# EAGLE design M239A (EAGLE 6.6.0)
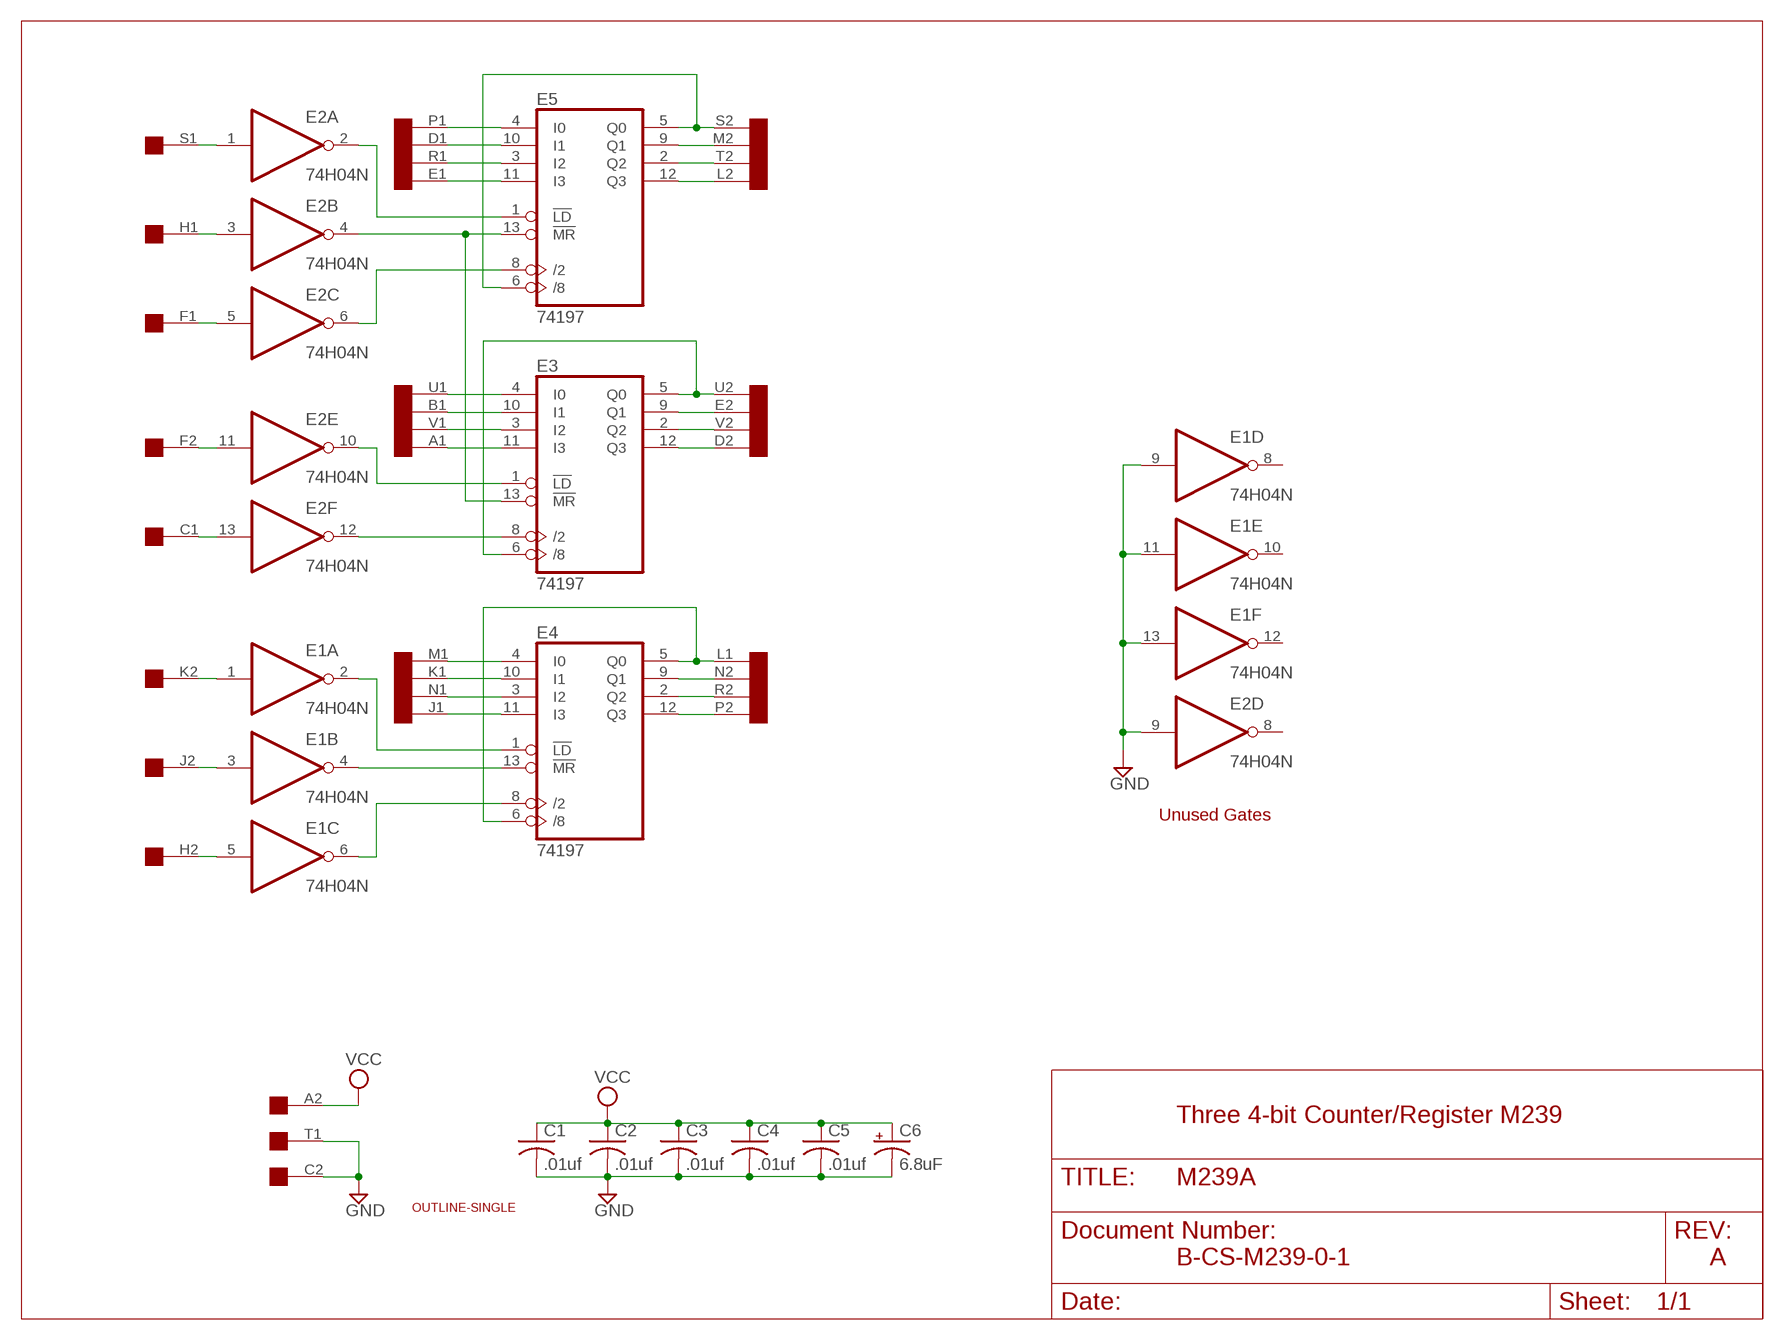
[diagram p0: schematic, sheet 1]

## Parts
C1  .01uf  C-US050-025X075  [C050-025X075]
C2  .01uf  C-US050-025X075  [C050-025X075]
C3  .01uf  C-US050-025X075  [C050-025X075]
C4  .01uf  C-US050-025X075  [C050-025X075]
C5  .01uf  C-US050-025X075  [C050-025X075]
C6  6.8uF  CPOL-USE22-6AXIAL  [E22-6]
E1  74H04N  7404N  [DIL14]
E2  74H04N  7404N  [DIL14]
E3  74197  74LS197  [DIL14]
E4  74197  74LS197  [DIL14]
E5  74197  74LS197  [DIL14]
U$1  OUTLINE-SINGLE  [SINGLE]
U$4  SINGLE  [EDGE-CON2]

## Nets
GND [Supply]: C1.2 C2.2 C3.2 C4.2 C5.2 C6.- E1.9(D:I) E1.11(E:I) E1.13(F:I) E2.9(D:I) U$4.C2 U$4.T1
N$1: E5.4(I0) U$4.P1
N$2: E5.10(I1) U$4.D1
N$3: E5.3(I2) U$4.R1
N$4: E5.11(I3) U$4.E1
N$5: E5.5(Q0) E5.6(/8) U$4.S2
N$6: E2.2(A:O) E5.1(!LD)
N$7: E2.4(B:O) E3.13(!MR) E5.13(!MR)
N$8: E2.6(C:O) E5.8(/2)
N$9: E2.1(A:I) U$4.S1
N$10: E2.3(B:I) U$4.H1
N$11: E2.5(C:I) U$4.F1
N$12: E2.10(E:O) E3.1(!LD)
N$13: E2.12(F:O) E3.8(/2)
N$14: E3.5(Q0) E3.6(/8) U$4.U2
N$15: E2.11(E:I) U$4.F2
N$16: E2.13(F:I) U$4.C1
N$17: E3.11(I3) U$4.A1
N$18: E3.3(I2) U$4.V1
N$19: E3.10(I1) U$4.B1
N$20: E3.4(I0) U$4.U1
N$21: E5.9(Q1) U$4.M2
N$22: E5.2(Q2) U$4.T2
N$23: E5.12(Q3) U$4.L2
N$24: E3.9(Q1) U$4.E2
N$25: E3.2(Q2) U$4.V2
N$26: E3.12(Q3) U$4.D2
N$27: E4.5(Q0) E4.6(/8) U$4.L1
N$28: E1.4(B:O) E4.13(!MR)
N$29: E1.6(C:O) E4.8(/2)
N$30: E1.2(A:O) E4.1(!LD)
N$31: E1.1(A:I) U$4.K2
N$32: E1.3(B:I) U$4.J2
N$33: E1.5(C:I) U$4.H2
N$34: E4.4(I0) U$4.M1
N$35: E4.10(I1) U$4.K1
N$36: E4.3(I2) U$4.N1
N$37: E4.11(I3) U$4.J1
N$38: E4.9(Q1) U$4.N2
N$39: E4.2(Q2) U$4.R2
N$40: E4.12(Q3) U$4.P2
VCC [Supply]: C1.1 C2.1 C3.1 C4.1 C5.1 C6.+ U$4.A2
Unconnected: E1.8(D:O) E1.10(E:O) E1.12(F:O) E2.8(D:O) U$4.B2

## Notes on the sheet
- Unused Gates
- Three 4-bit Counter/Register M239
- B-CS-M239-0-1 | A

## Power pins joined to a net without a drawn wire
GND: E1.7(P:GND) E2.7(P:GND) E3.7(GND) E4.7(GND) E5.7(GND)
VCC: E1.14(P:VCC) E2.14(P:VCC) E3.14(VCC) E4.14(VCC) E5.14(VCC)

## Library data of the parts
C1-C5 = rcl:C-US: CAPACITOR, American symbol
C6 = rcl:CPOL-US: POLARIZED CAPACITOR, American symbol
E1 E2 = 74xx-us:74*04: Hex INVERTER
E3-E5 = dec-con:74LS197: Loadable decade counter
U$1 = dec-con:OUTLINE-*: Board outlines for DEC boards.
U$4 = dec-con:SINGLE: Single-Height DEC board

## Net classes
1 Supply: width 0.813 mm

## Board
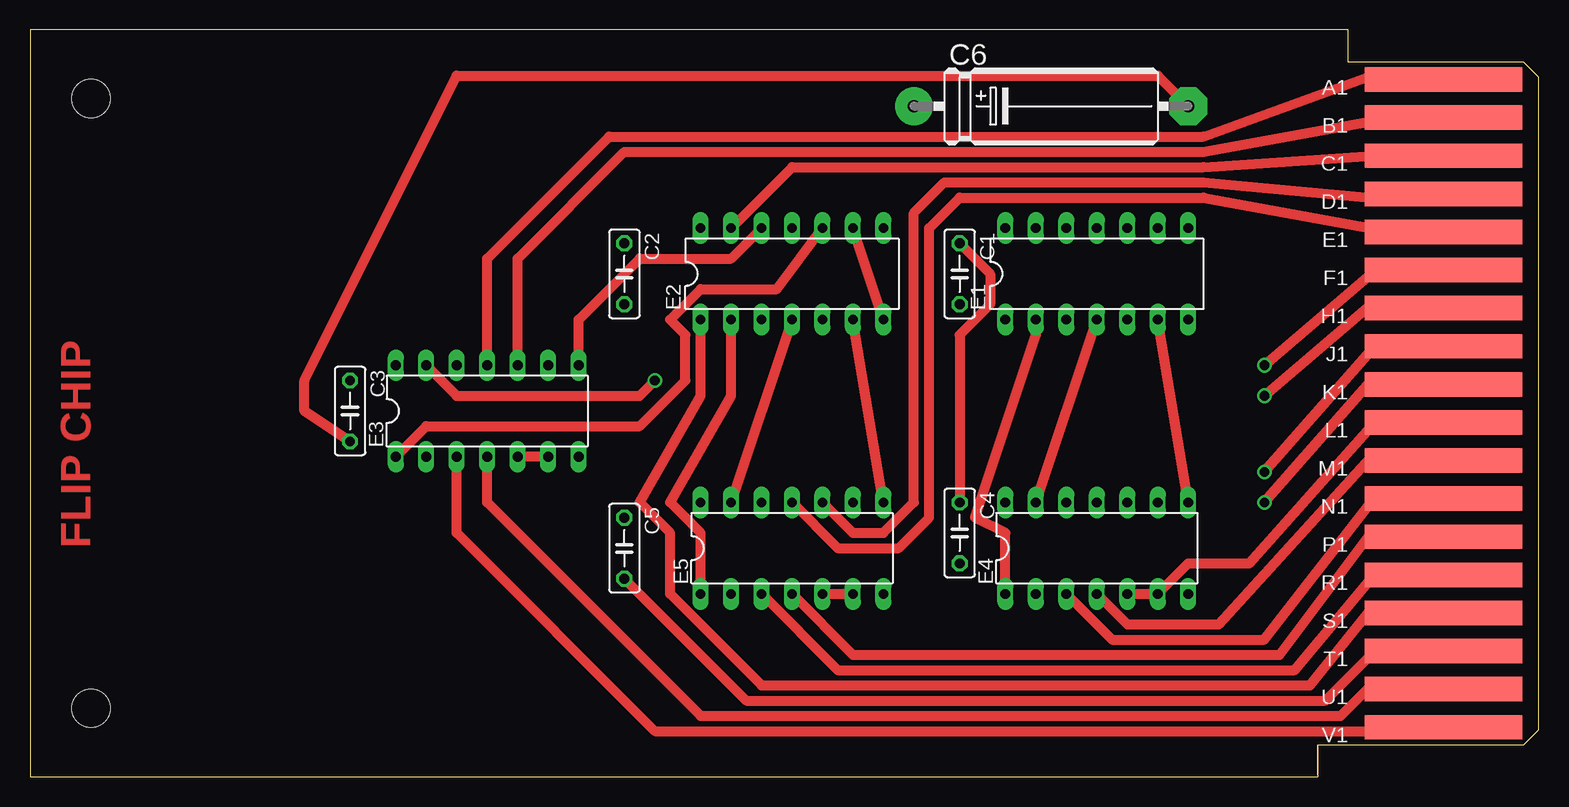
[diagram p1: board, top side]
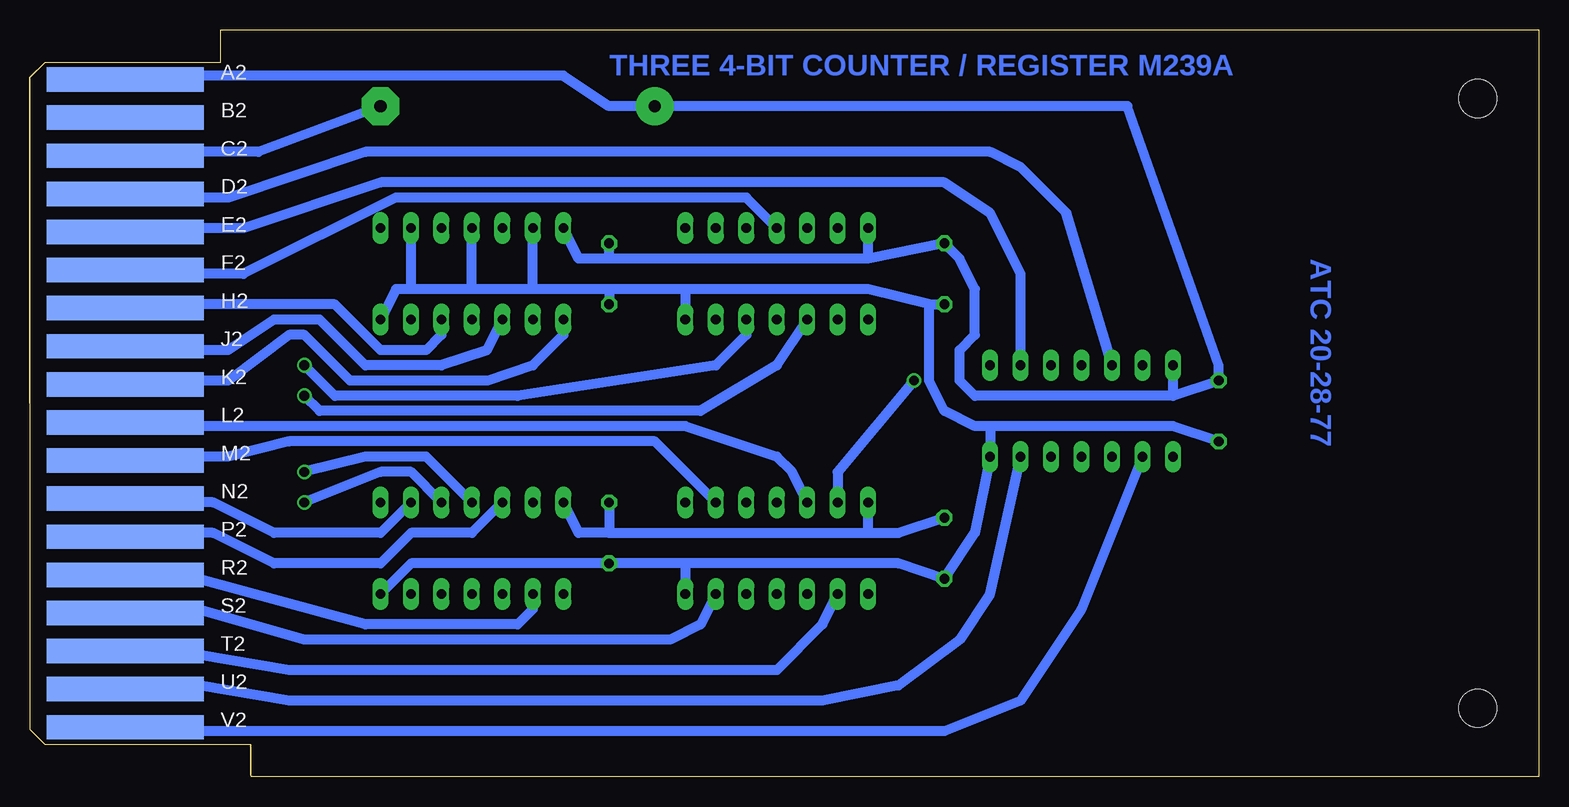
[diagram p2: board, bottom side, seen from below]

Size 125.73 x 62.23 mm. Coordinates in mm from the lower left corner, seen from the top.
Copper layers (1+16): Top 0.035mm / dielectric 1.5mm / Bottom 0.035mm
Design rules "16mils": minimum track width 16mil, minimum drill 32mil, track to track 15mil, track to pad 10mil, pad to pad 10mil, via to via 10mil, smd to smd 10mil, copper to edge 25mil, drill to drill 10mil, minimum pad ring 10mil, minimum via ring 8mil, stop-mask expansion 0mil, vias tented up to drill 0mil, thermal gap 10mil

### Footprints (pad centres in the part's own frame; a part is rotated, then mirrored left to right if it is on the bottom)
C050-025X075 = drill 0.813 octagon: 1 -2.54,0; 2 2.54,0
E22-6 = drill 1.016 pad 3.15: + -11.43,0 | drill 1.016 pad 3.15 octagon: - 11.43,0
DIL14 = drill 0.813 long: 1 -7.62,-3.81; 2 -5.08,-3.81; 3 -2.54,-3.81; 4 0,-3.81; 5 2.54,-3.81; 6 5.08,-3.81; 7 7.62,-3.81; 8 7.62,3.81; 9 5.08,3.81; 10 2.54,3.81; 11 0,3.81; 12 -2.54,3.81; 13 -5.08,3.81; 14 -7.62,3.81
SINGLE = hole 3.175: 120.65,56.515; 120.65,5.715
EDGE-CON2 = smd 13.106 x 2.032: A1 7.938,4.128; B1 7.938,7.303; C1 7.938,10.477; D1 7.938,13.652; E1 7.938,16.828; F1 7.938,20.003; H1 7.938,23.177; J1 7.938,26.352; K1 7.938,29.527; L1 7.938,32.703; M1 7.938,35.877; N1 7.938,39.053; P1 7.938,42.227; R1 7.938,45.403; S1 7.938,48.578; T1 7.938,51.752; U1 7.938,54.928; V1 7.938,58.102 | smd 13.106 x 2.032 bottom: A2 7.938,4.128; B2 7.938,7.303; C2 7.938,10.477; D2 7.938,13.652; E2 7.938,16.828; F2 7.938,20.003; H2 7.938,23.177; J2 7.938,26.352; K2 7.938,29.527; L2 7.938,32.703; M2 7.938,35.877; N2 7.938,39.053; P2 7.938,42.227; R2 7.938,45.403; S2 7.938,48.578; T2 7.938,51.752; U2 7.938,54.928; V2 7.938,58.102

### Placement (x,y rotation side)
C1  77.47,41.91 270 top
C2  49.53,41.91 270 top
C3  26.67,30.48 270 top
C4  77.47,20.32 270 top
C5  49.53,19.05 270 top
C6  85.09,55.88 0 top
E1  88.9,41.91 0 top
E2  63.5,41.91 0 top
E3  38.1,30.48 0 top
E4  88.9,19.05 0 top
E5  63.5,19.05 0 top
U$1  125.73,62.23 180 top
U$4  125.73,62.23 180 top
U$5  [FLIPCHIP]  0,0 0 top

### Tracks (layer width: path | path; a pad name or v marks a point on that pad's centre or on a via)
GND
  Top 0.813: C6.- 93.98,58.42 35.56,58.42 22.86,33.02 22.86,30.48 C3.2 | U$4.T1 115.57,10.16 111.76,10.16 107.95,6.35 59.69,6.35 C5.2 | E2.7 E2.9
  Bottom 0.813: U$4.C2 117.17,51.74 116.84,52.07 106.68,52.07 C6.- | E4.7 93.98,17.78 C4.2 71.12,17.78 | 71.12,17.78 53.34,17.78 C5.2 46.99,20.32 E3.7 45.72,29.21 | C3.2 30.48,29.21 45.72,29.21 | 45.72,29.21 46.99,29.21 49.53,30.48 50.8,33.02 50.8,39.37 | 50.8,39.37 C2.2 | 71.12,40.64 E2.7 | 71.12,40.64 55.88,40.64 50.8,39.37 | E1.7 95.25,40.64 93.98,40.64 | 71.12,40.64 77.47,40.64 | 77.47,40.64 83.82,40.64 | 83.82,40.64 88.9,40.64 | 88.9,40.64 93.98,40.64 | 83.82,40.64 E1.13 | 88.9,40.64 E1.11 | 93.98,40.64 E1.9 | 77.47,40.64 C1.2 | 71.12,17.78 E5.7
N$1
  Top 0.813: E5.4 68.58,10.16 104.14,10.16 111.76,20.32 116.84,20.32 U$4.P1
N$2
  Top 0.813: U$4.D1 116.84,48.26 111.76,48.26 97.79,49.53 76.2,49.53 73.66,46.99 73.66,22.86 71.12,20.32 68.58,20.32 E5.10
N$3
  Top 0.813: U$4.R1 116.84,16.51 111.76,16.51 105.41,8.89 67.31,8.89 E5.3
N$4
  Top 0.813: U$4.E1 116.84,45.72 111.76,45.72 97.79,48.26 77.47,48.26 74.93,45.72 74.93,21.59 72.39,19.05 67.31,19.05 E5.11
N$5
  Top 0.813: E5.5 E5.6
  Bottom 0.813: U$4.S2 116.84,13.97 111.76,13.97 102.87,11.43 72.39,11.43 69.85,12.7 E5.6
N$6
  Top 0.813: E5.1 55.88,20.32 53.34,22.86 58.42,31.75 E2.2
N$7  (via drill 0.81)
  Top 0.813: E5.13 E2.4 | E3.13 35.56,31.75 50.8,31.75 v52.07,33.02
  Bottom 0.813: E5.13 58.42,25.4 v52.07,33.02
N$8
  Top 0.813: E5.8 E2.6
N$9
  Top 0.813: E2.1 55.88,31.75 50.8,22.86 53.34,20.32 53.34,15.24 60.96,7.62 106.68,7.62 111.76,13.97 116.84,13.97 U$4.S1
N$10  (via drill 0.81)
  Top 0.813: U$4.H1 116.84,39.37 111.76,39.37 v102.87,31.75
  Bottom 0.813: E2.3 63.5,34.29 69.85,30.48 101.6,30.48 v102.87,31.75
N$11  (via drill 0.81)
  Top 0.813: U$4.F1 116.84,41.91 111.76,41.91 v102.87,34.29
  Bottom 0.813: E2.5 66.04,36.83 68.58,34.29 85.09,31.75 100.33,31.75 v102.87,34.29
N$12
  Top 0.813: E3.1 33.02,29.21 50.8,29.21 54.61,33.02 54.61,36.83 53.34,38.1 55.88,40.64 62.23,40.64 E2.10
N$13
  Top 0.813: E2.12 58.42,43.18 50.8,43.18 45.72,38.1 E3.8
N$14
  Top 0.813: E3.6 E3.5
  Bottom 0.813: E3.6 45.72,15.24 48.26,11.43 53.34,7.62 59.69,6.35 104.14,6.35 111.76,7.62 116.84,7.62 U$4.U2
N$15
  Bottom 0.813: U$4.F2 116.84,41.91 107.95,41.91 95.25,48.26 66.04,48.26 E2.11
N$16
  Top 0.813: U$4.C1 116.84,52.07 97.79,50.8 63.5,50.8 E2.13
N$17
  Top 0.813: U$4.A1 116.84,58.42 111.76,58.42 97.79,53.34 48.26,53.34 38.1,43.18 E3.11
N$18
  Top 0.813: U$4.V1 116.84,3.81 52.07,3.81 35.56,20.32 E3.3
N$19
  Top 0.813: U$4.B1 116.84,54.61 111.76,54.61 97.79,52.07 49.53,52.07 40.64,43.18 E3.10
N$20
  Top 0.813: U$4.U1 116.84,7.62 111.76,7.62 109.22,5.08 55.88,5.08 38.1,22.86 E3.4
N$21
  Bottom 0.813: E5.9 73.66,27.94 104.14,27.94 109.22,26.67 116.84,26.67 U$4.M2
N$22
  Bottom 0.813: E5.2 59.69,12.7 63.5,8.89 104.14,8.89 111.76,10.16 116.84,10.16 U$4.T2
N$23
  Bottom 0.813: E5.12 62.23,25.4 63.5,26.67 71.12,29.21 116.84,29.21 U$4.L2
N$24
  Bottom 0.813: E3.9 43.18,41.91 45.72,46.99 49.53,49.53 96.52,49.53 107.95,45.72 116.84,45.72 U$4.E2
N$25
  Bottom 0.813: U$4.V2 116.84,3.81 49.53,3.81 43.18,6.35 38.1,13.97 E3.2
N$26
  Bottom 0.813: E3.12 39.37,46.99 43.18,50.8 45.72,52.07 97.79,52.07 109.22,48.26 116.84,48.26 U$4.D2
N$27
  Top 0.813: E4.5 E4.6 96.52,17.78 101.6,17.78 111.76,29.21 116.84,29.21 U$4.L1
N$28
  Top 0.813: E4.13 E1.4
N$29
  Top 0.813: E4.8 E1.6
N$30
  Top 0.813: E4.1 81.28,20.32 78.74,21.59 83.82,36.83 E1.2
N$31
  Bottom 0.813: E1.1 81.28,36.83 83.82,34.29 87.63,33.02 99.06,33.02 102.87,36.83 104.14,36.83 109.22,33.02 116.84,33.02 U$4.K2
N$32
  Bottom 0.813: E1.3 87.63,35.56 91.44,34.29 97.79,34.29 101.6,38.1 105.41,38.1 109.22,35.56 116.84,35.56 U$4.J2
N$33
  Bottom 0.813: U$4.H2 116.84,39.37 100.33,39.37 96.52,35.56 92.71,35.56 91.44,36.83 E1.5
N$34
  Top 0.813: U$4.M1 116.84,26.67 111.76,26.67 99.06,12.7 91.44,12.7 E4.4
N$35  (via drill 0.81)
  Top 0.813: U$4.K1 116.84,33.02 111.76,33.02 v102.87,22.86
  Bottom 0.813: E4.10 93.98,25.4 96.52,25.4 v102.87,22.86
N$36
  Top 0.813: U$4.N1 116.84,22.86 111.76,22.86 102.87,11.43 90.17,11.43 E4.3
N$37  (via drill 0.81)
  Top 0.813: U$4.J1 116.84,35.56 111.76,35.56 v102.87,25.4
  Bottom 0.813: E4.11 92.71,26.67 97.79,26.67 v102.87,25.4
N$38
  Bottom 0.813: E4.9 96.52,20.32 105.41,20.32 110.49,22.86 116.84,22.86 U$4.N2
N$39
  Bottom 0.813: E4.2 83.82,13.97 85.09,12.7 97.79,12.7 111.76,16.51 116.84,16.51 U$4.R2
N$40
  Bottom 0.813: U$4.P2 116.84,20.32 110.49,20.32 105.41,17.78 96.52,17.78 93.98,20.32 88.9,20.32 E4.12
VCC
  Top 0.813: C1.1 80.01,41.91 80.01,39.37 77.47,36.83 C4.1
  Bottom 0.813: U$4.A2 116.84,58.42 81.28,58.42 77.47,55.88 C6.+ 34.29,55.88 26.67,34.29 C3.1 30.48,31.75 | C5.1 53.34,20.32 55.88,20.32 | 77.47,20.32 55.88,20.32 | 77.47,20.32 80.01,20.32 E4.14 | C4.1 77.47,20.32 | 30.48,31.75 46.99,31.75 48.26,33.02 48.26,35.56 46.99,36.83 46.99,40.64 48.26,43.18 C2.1 55.88,43.18 | 30.48,31.75 E3.14 | 55.88,20.32 E5.14 | 55.88,43.18 77.47,43.18 | 77.47,43.18 80.01,43.18 E1.14 | 77.47,43.18 C1.1 | 55.88,43.18 E2.14

### Text on the board
Bottom: THREE 4-BIT COUNTER / REGISTER M239A | ATC 20-28-77